# EAGLE schematic TFG_V.1.1 (EAGLE 9.6.2)
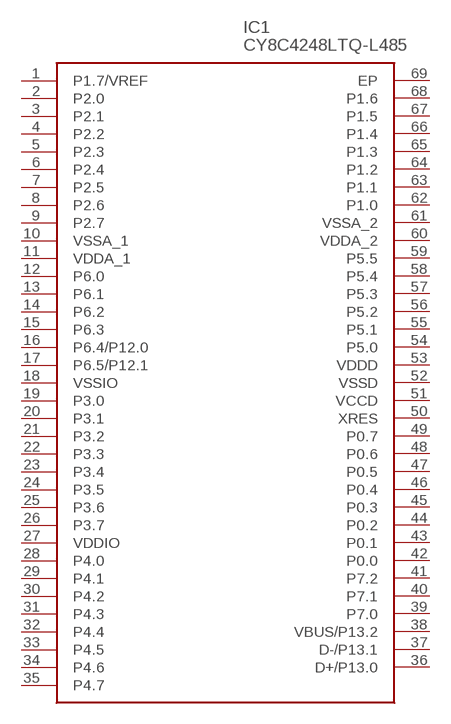
[diagram p0: schematic, sheet 1]

## Parts
IC1  CY8C4248LTQ-L485  [QFN40P800X800X100-69N]
Unconnected: IC1.1(P1.7/VREF) IC1.2(P2.0) IC1.3(P2.1) IC1.4(P2.2) IC1.5(P2.3) IC1.6(P2.4) IC1.7(P2.5) IC1.8(P2.6) IC1.9(P2.7) IC1.10(VSSA_1) IC1.11(VDDA_1) IC1.12(P6.0) IC1.13(P6.1) IC1.14(P6.2) IC1.15(P6.3) IC1.16(P6.4/P12.0) IC1.17(P6.5/P12.1) IC1.18(VSSIO) IC1.19(P3.0) IC1.20(P3.1) IC1.21(P3.2) IC1.22(P3.3) IC1.23(P3.4) IC1.24(P3.5) IC1.25(P3.6) IC1.26(P3.7) IC1.27(VDDIO) IC1.28(P4.0) IC1.29(P4.1) IC1.30(P4.2) IC1.31(P4.3) IC1.32(P4.4) IC1.33(P4.5) IC1.34(P4.6) IC1.35(P4.7) IC1.36(D+/P13.0) IC1.37(D-/P13.1) IC1.38(VBUS/P13.2) IC1.39(P7.0) IC1.40(P7.1) IC1.41(P7.2) IC1.42(P0.0) IC1.43(P0.1) IC1.44(P0.2) IC1.45(P0.3) IC1.46(P0.4) IC1.47(P0.5) IC1.48(P0.6) IC1.49(P0.7) IC1.50(XRES) IC1.51(VCCD) IC1.52(VSSD) IC1.53(VDDD) IC1.54(P5.0) IC1.55(P5.1) IC1.56(P5.2) IC1.57(P5.3) IC1.58(P5.4) IC1.59(P5.5) IC1.60(VDDA_2) IC1.61(VSSA_2) IC1.62(P1.0) IC1.63(P1.1) IC1.64(P1.2) IC1.65(P1.3) IC1.66(P1.4) IC1.67(P1.5) IC1.68(P1.6) IC1.69(EP)

## Library data of the parts
IC1 = CY8C4248LTQ-L485:CY8C4248LTQ-L485: ARM Microcontrollers - MCU PSoC4 Source: Datasheet <https://www.infineon.com/dgdl/Infineon-PSoC_4_PSoC_4200L_Family-DataSheet-v12_00-EN.pdf?fileId=8ac78c8c7d0d8da4017d0ed894aa5a14>; DESCRIPTION: ARM Microcontrollers - MCU PSoC4; HEIGHT: 1mm; MANUFACTURER_NAME: Infineon; MANUFACTURER_PART_NUMBER: CY8C4248LTQ-L485